# Altium schematic sheet ads1118.SchDoc
size A
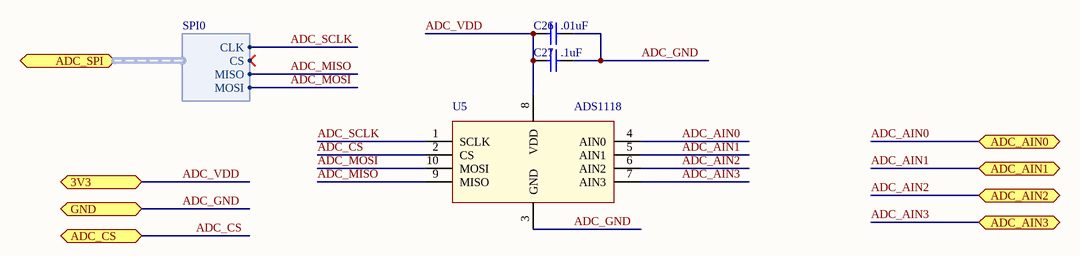
[diagram p0: ads1118.SchDoc]

## Parts
C26  value .01uF  [0805]  (hidden comment: CAP)
C27  value .1uF  [0805]  (hidden comment: CAP)
U5  ADS1118  [TSSOP50P490X110-10N]

## Ports
3V3, ADC_AIN0, ADC_AIN1, ADC_AIN2, ADC_AIN3, ADC_CS, ADC_SPI (harness SPI0), GND

## Harnesses
SPI0: CLK, CS, MISO, MOSI

## Nets
ADC_AIN0: U5.4(AIN0) ; port ADC_AIN0
ADC_AIN1: U5.5(AIN1) ; port ADC_AIN1
ADC_AIN2: U5.6(AIN2) ; port ADC_AIN2
ADC_AIN3: U5.7(AIN3) ; port ADC_AIN3
ADC_CS: U5.2(CS) ; port ADC_CS
ADC_GND: C26.1 C27.1 U5.3(GND) ; port GND
ADC_MISO: U5.9(MISO) ; port ADC_SPI.MISO
ADC_MOSI: U5.10(MOSI) ; port ADC_SPI.MOSI
ADC_SCLK: U5.1(SCLK) ; port ADC_SPI.CLK
ADC_VDD: C26.2 C27.2 U5.8(VDD) ; port 3V3

## Notes on the sheet
- Title
- Size:
- Date:
- A
- Number:
- Time:
- Revision:
- Sheet
- of
- File:

## Library data of the parts
C26 C27 = CAP: Tolerance: 5%; Voltage: 10V; Manufacturer: *; Manufacturer P/N: *; Tr: *; Distributor: Digi-Key; Distributor P/N: *
U5 = ADS1118: ADC for precision thermocouples; Manufacturer: TI; Manufacturer P/N: ADS1118; Distributor: DigiKey; Distributor P/N: 296-29207-1-ND